# Altium project DigiBuckBoostConverter.PrjPcb
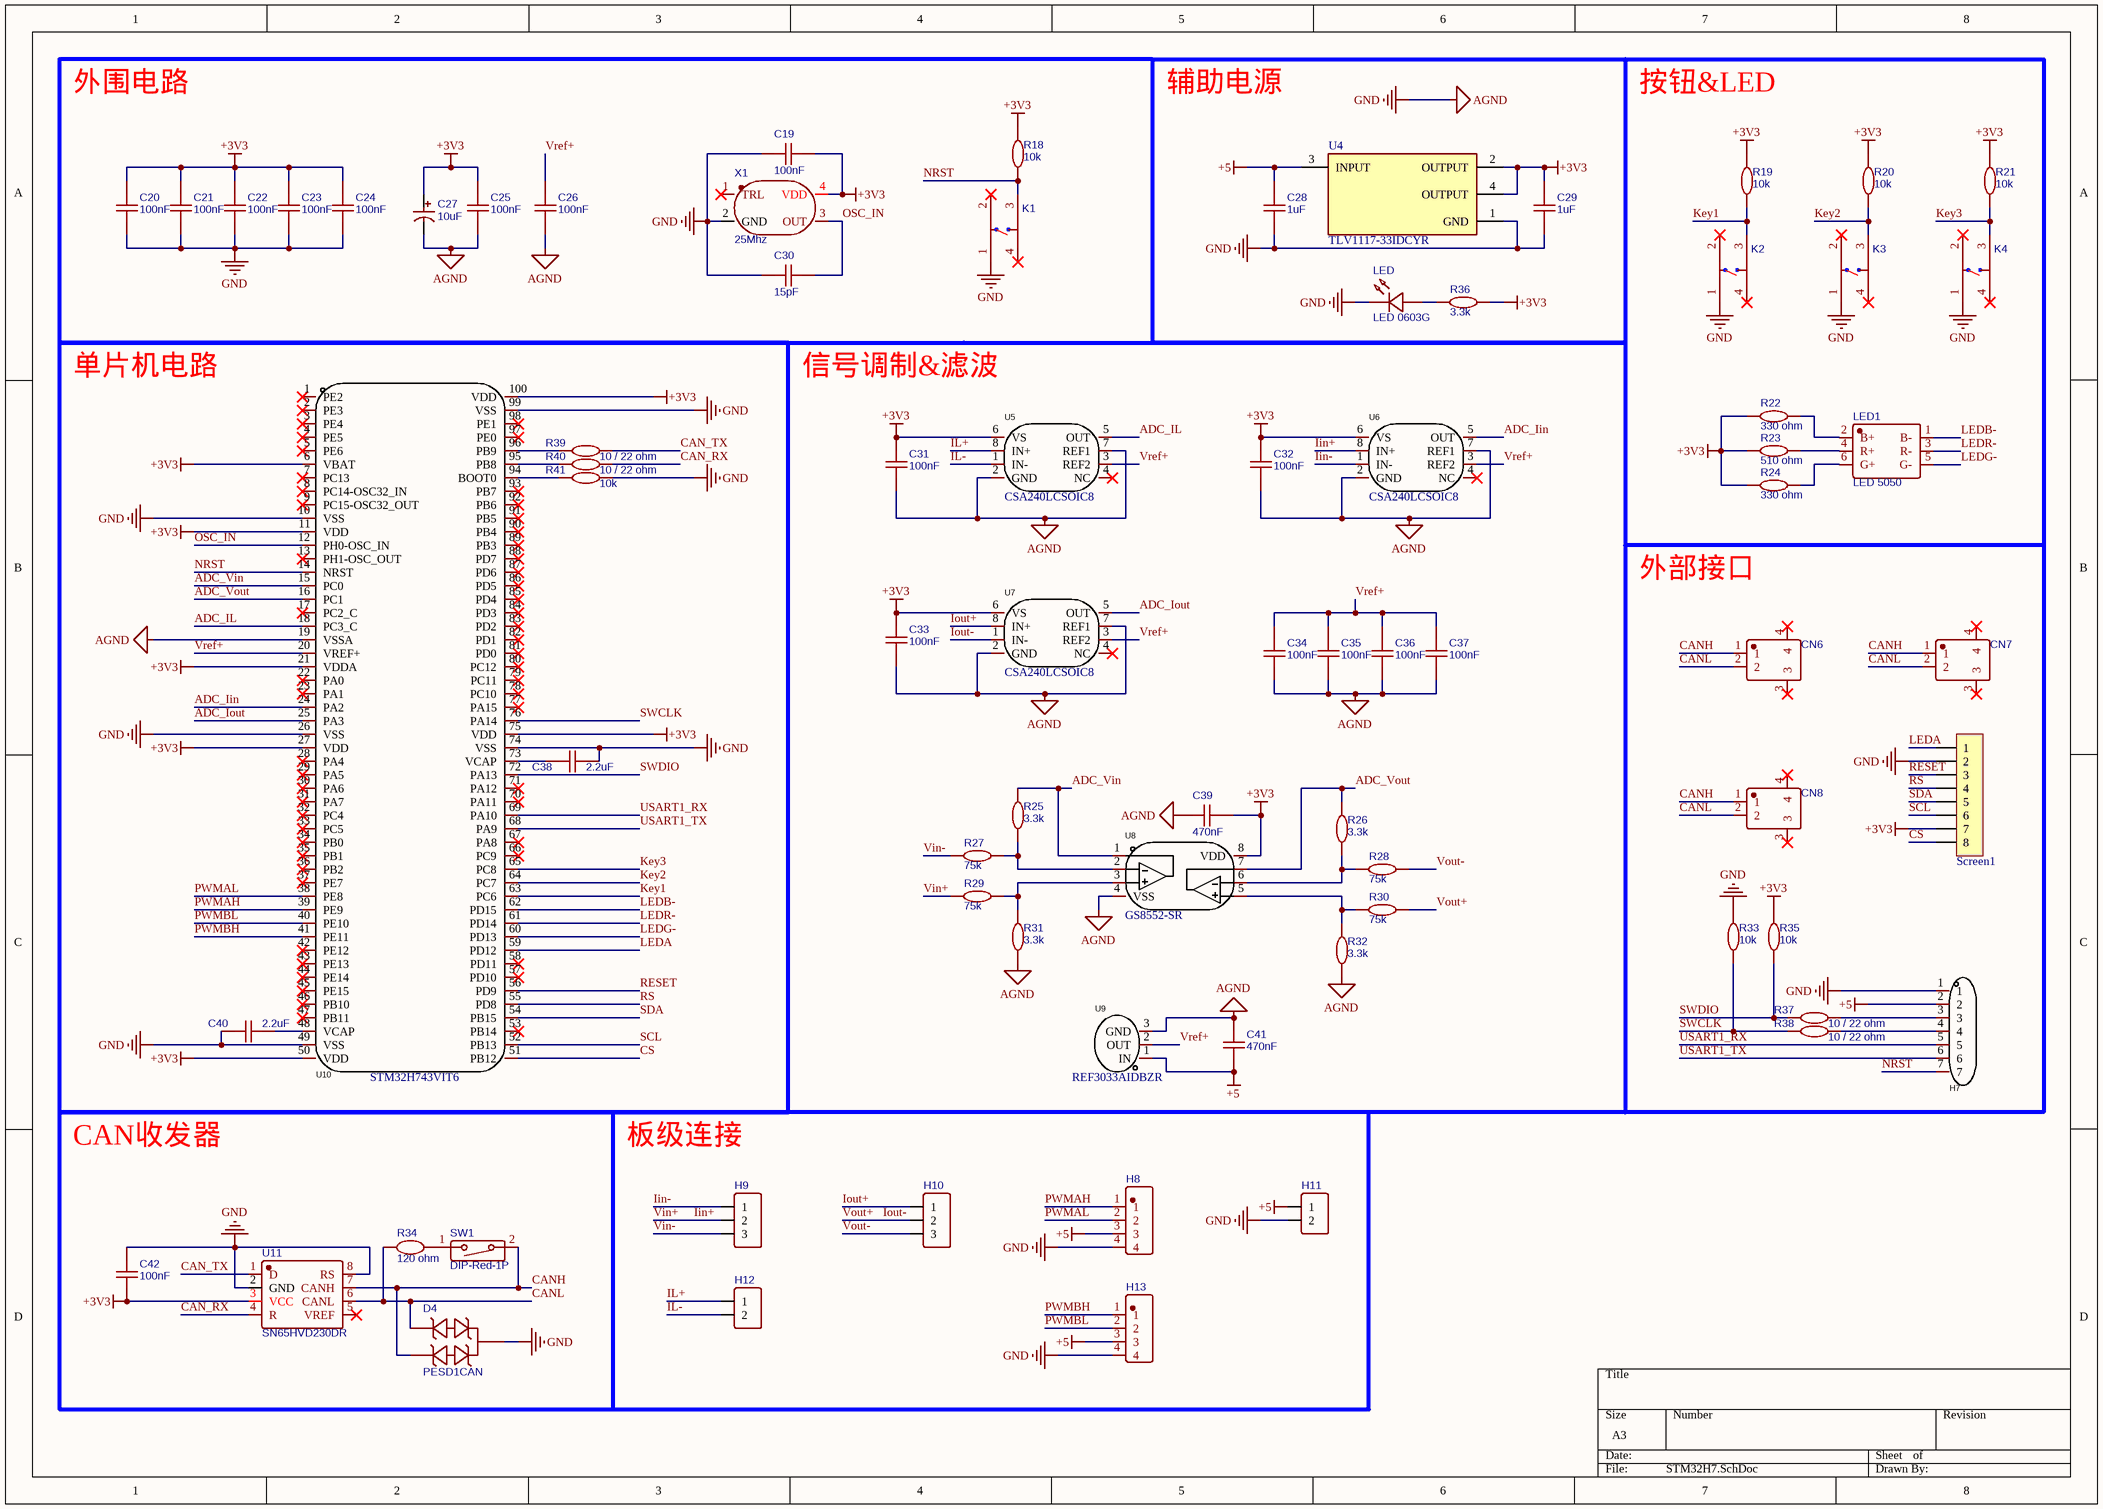
[diagram p0: STM32H7.SchDoc]
1 sheet, 76 parts. Net scope: global (net labels, ports and power ports of the same name join across sheets).
Board files: STM32H7.PcbDoc, mainPower_V2.PcbDoc

## Sheet STM32H7.SchDoc
size A3; SheetNumber: 2; SheetTotal: 2

### Parts
C19  100nF  [C0603]
C20  100nF  [C0603]
C21  100nF  [C0603]
C22  100nF  [C0603]
C23  100nF  [C0603]
C24  100nF  [C0603]
C25  100nF  [C0603]
C26  100nF  [C0603]
C27  10uF  [CD A(3216)]
C28  1uF  [C0603]
C29  1uF  [C0603]
C30  15pF  [C0603]
C31  100nF  [C0603]
C32  100nF  [C0603]
C33  100nF  [C0603]
C34  100nF  [C0603]
C35  100nF  [C0603]
C36  100nF  [C0603]
C37  100nF  [C0603]
C38  2.2uF  [C0603]
C39  470nF  [C0603]
C40  2.2uF  [C0603]
C41  470nF  [C0603]
C42  100nF  [C0603]
CN6  A1257WR-S-2P  [CONN-SMD_A1257WR-S-2P]  (value not drawn)
CN7  A1257WR-S-2P  [CONN-SMD_A1257WR-S-2P]  (value not drawn)
CN8  A1257WR-S-2P  [CONN-SMD_A1257WR-S-2P]  (value not drawn)
D4  PESD1CAN  [SOT-23-3_L2.9-W1.6-P1.90-LS2.8-BR]
H7  7P卧贴排母  [HDR-SMD_7P-P2.54-H-F-L11.5]  (value not drawn)
H8  Header-Female-2.54_1x4  [HDR2.54-M-LI-4P]  (value not drawn)
H9  Header-Female-2.54_1x3  [HDR2.54-M-LI-3P]  (value not drawn)
H10  Header-Female-2.54_1x3  [HDR2.54-M-LI-3P]  (value not drawn)
H11  Header-Female-2.54_1x2  [HDR2.54-M-LI-2P]  (value not drawn)
H12  Header-Female-2.54_1x2  [HDR2.54-M-LI-2P]  (value not drawn)
H13  Header-Female-2.54_1x4  [HDR2.54-M-LI-4P]  (value not drawn)
K1  TSW SMD-6*6*5  [TSW SMD-6*6*5]  (value not drawn)
K2  TSW SMD-6*6*5  [TSW SMD-6*6*5]  (value not drawn)
K3  TSW SMD-6*6*5  [TSW SMD-6*6*5]  (value not drawn)
K4  TSW SMD-6*6*5  [TSW SMD-6*6*5]  (value not drawn)
LED  LED 0603G  [LED 0603G]
LED1  LED 5050  [LED 5050]
R18  10k  [R0603]
R19  10k  [R0603]
R20  10k  [R0603]
R21  10k  [R0603]
R22  330 ohm  [R0603]
R23  510 ohm  [R0603]
R24  330 ohm  [R0603]
R25  3.3k  [R0603]
R26  3.3k  [R0603]
R27  75k  [R0603]
R28  75k  [R0603]
R29  75k  [R0603]
R30  75k  [R0603]
R31  3.3k  [R0603]
R32  3.3k  [R0603]
R33  10k  [R0603]
R34  120 ohm  [R0805]
R35  10k  [R0603]
R36  3.3k  [R0603]
R37  10 / 22 ohm  [R0603]
R38  10 / 22 ohm  [R0603]
R39  10 / 22 ohm  [R0603]
R40  10 / 22 ohm  [R0603]
R41  10k  [R0603]
Screen1  FPC1.0-8P  [FPC0.5 2H-S-W-8P]  (value not drawn)
SW1  DIP-Red-1P  [CSW DIP-1P_G]
U4  TLV1117-33IDCYR  [FP-DCY0004A-MFG]
U5  CSA240LCSOIC8  [SOIC-8_L4.9-W3.9-P1.27-LS6.0-BL]
U6  CSA240LCSOIC8  [SOIC-8_L4.9-W3.9-P1.27-LS6.0-BL]
U7  CSA240LCSOIC8  [SOIC-8_L4.9-W3.9-P1.27-LS6.0-BL]
U8  GS8552-SR  [SOIC-8_L4.9-W3.9-P1.27-LS6.0-BL]
U9  REF3033AIDBZR  [SOT-23-3_L3.0-W1.7-P0.95-LS2.9-BR]
U10  STM32H743VIT6  [LQFP-100_L14.0-W14.0-P0.50-LS16.0-BL]
U11  SN65HVD230DR  [SOP-8]
X1  25Mhz  [OSC 3225-4P]

### Blocks framed on the sheet
外围电路: C19-C27 C30 K1 R18 X1
辅助电源: C28 C29 LED R36 U4
单片机电路: C38 C40 R39-R41 U10
信号调制&滤波: C31-C37 C39 C41 R25-R32 U5-U9

### Nets
+3V3: C19.2 C20.2 C21.2 C22.2 C23.2 C24.2 C25.1 C27.1 C29.2 C31.2 C32.2 C33.2 C39.2 C42.1 R18.2 R19.2 R20.2 R21.2 R22.2 R23.2 R24.2 R35.2 R36.1 Screen1.7 U4.2(OUTPUT) U4.4(OUTPUT) U5.6(VS) U6.6(VS) U7.6(VS) U8.8(VDD) U10.6(VBAT) U10.11(VDD) U10.21(VDDA) U10.27(VDD) U10.50(VDD) U10.75(VDD) U10.100(VDD) U11.3(VCC) X1.4(VDD)
+5: C28.2 C41.1 H7.2 H8.3 H11.1 H13.3 U4.3(INPUT) U9.1(IN)
AGND: C19.1 C20.1 C21.1 C22.1 C23.1 C24.1 C25.2 C26.1 C27.2 C28.1 C29.1 C30.2 C31.1 C32.1 C33.1 C34.2 C35.1 C36.1 C37.2 C38.1 C39.1 C40.2 C41.2 C42.2 D4.3 H7.1 H8.4 H11.2 H13.4 K1.1 K2.1 K3.1 K4.1 LED.2(K) R31.1 R32.1 R33.2 R41.1 Screen1.2 U4.1(GND) U5.2(GND) U5.7(REF1) U6.2(GND) U6.7(REF1) U7.2(GND) U7.7(REF1) U8.4(VSS) U9.3(GND) U10.10(VSS) U10.19(VSSA) U10.26(VSS) U10.49(VSS) U10.74(VSS) U10.99(VSS) U11.2(GND) U11.8(RS) X1.2(GND)  [also labelled GND]
ADC_Iin: U6.5(OUT) U10.24(PA2)
ADC_IL: U5.5(OUT) U10.18(PC3_C)
ADC_Iout: U7.5(OUT) U10.25(PA3)
ADC_Vin: R25.2 U8.1(OUTA) U10.15(PC0)
ADC_Vout: R26.2 U8.7(OUTB) U10.16(PC1)
CAN_RX: R40.1 U11.4(R)
CAN_TX: R39.1 U11.1(D)
CANH: CN6.1 CN7.1 CN8.1 D4.2 SW1.2 U11.7(CANH)
CANL: CN6.2 CN7.2 CN8.2 D4.1 R34.1 U11.6(CANL)
CS: Screen1.8 U10.51(PB12)
Iin+: H9.2 R29.1 U6.8(IN+)  [also labelled Vin+]
Iin-: H9.1 U6.1(IN-)
IL+: H12.1 U5.8(IN+)
IL-: H12.2 U5.1(IN-)
Iout+: H10.1 U7.8(IN+)
Iout-: H10.2 R30.2 U7.1(IN-)  [also labelled Vout+]
Key1: K2.3 R19.1 U10.63(PC6)
Key2: K3.3 R20.1 U10.64(PC7)
Key3: K4.3 R21.1 U10.65(PC8)
LEDA: Screen1.1 U10.59(PD12)
LEDB-: LED1.1(B-) U10.62(PD15)
LEDG-: LED1.5(G-) U10.60(PD13)
LEDR-: LED1.3(R-) U10.61(PD14)
NRST: H7.7 K1.3 R18.1 U10.14(NRST)
OSC_IN: C30.1 U10.12(PH0-OSC_IN) X1.3(OUT)
PWMAH: H8.1 U10.39(PE9)
PWMAL: H8.2 U10.38(PE8)
PWMBH: H13.1 U10.41(PE11)
PWMBL: H13.2 U10.40(PE10)
RESET: Screen1.3 U10.56(PD9)
RS: Screen1.4 U10.55(PD8)
SCL: Screen1.6 U10.52(PB13)
SDA: Screen1.5 U10.54(PB15)
SWCLK: R33.1 R38.2 U10.76(PA14)
SWDIO: R35.1 R37.2 U10.72(PA13)
USART1_RX: H7.5 U10.69(PA10)
USART1_TX: H7.6 U10.68(PA9)
Vin-: H9.3 R27.1
Vout-: H10.3 R28.2
Vref+: C26.2 C34.1 C35.2 C36.2 C37.1 U5.3(REF2) U6.3(REF2) U7.3(REF2) U9.2(OUT) U10.20(VREF+)
NetC38_2: C38.2 U10.73(VCAP)
NetC40_1: C40.1 U10.48(VCAP)
NetH7_3: H7.3 R37.1
NetH7_4: H7.4 R38.1
NetLED1_2: LED1.2(B+) R22.1
NetLED1_4: LED1.4(R+) R23.1
NetLED1_6: LED1.6(G+) R24.1
NetLED_1: LED.1(A) R36.2
NetR25_1: R25.1 R27.2 U8.2(INA-)
NetR26_1: R26.1 R28.1 U8.6(INB-)
NetR29_2: R29.2 R31.2 U8.3(INA+)
NetR30_1: R30.1 R32.2 U8.5(INB+)
NetR34_2: R34.2 SW1.1
NetR39_2: R39.2 U10.96(PB9)
NetR40_2: R40.2 U10.95(PB8)
NetR41_2: R41.2 U10.94(BOOT0)

Not connected (* = marked no-connect by the designer): CN6 3* 4*; CN7 3* 4*; CN8 3* 4*; K1 2* 4*; K2 2* 4*; K3 2* 4*; K4 2* 4*; U5 4(NC)*; U6 4(NC)*; U7 4(NC)*; U10 1(PE2)* 2(PE3)* 3(PE4)* 4(PE5)* 5(PE6)* 7(PC13)* 8(PC14-OSC32_IN)* 9(PC15-OSC32_OUT)* 13(PH1-OSC_OUT)* 17(PC2_C)* 22(PA0)* 23(PA1)* 28(PA4)* 29(PA5)* 30(PA6)* 31(PA7)* 32(PC4)* 33(PC5)* 34(PB0)* 35(PB1)* 36(PB2)* 37(PE7)* 42(PE12)* 43(PE13)* 44(PE14)* 45(PE15)* 46(PB10)* 47(PB11)* 53(PB14)* 57(PD10)* 58(PD11)* 66(PC9)* 67(PA8)* 70(PA11)* 71(PA12)* 77(PA15)* 78(PC10)* 79(PC11)* 80(PC12)* 81(PD0)* 82(PD1)* 83(PD2)* 84(PD3)* 85(PD4)* 86(PD5)* 87(PD6)* 88(PD7)* 89(PB3)* 90(PB4)* 91(PB5)* 92(PB6)* 93(PB7)* 97(PE0)* 98(PE1)*; U11 5(VREF)*; X1 1(TRL)*

### Notes on the sheet
- 按钮&LED
- 外部接口
- CAN收发器
- 板级连接

### Library data of the parts
C19-C26 C28-C42 = C0603: BOM_Manufacturer: YAGEO; BOM_Manufacturer Part: CC0603KRX7R9BB104; nameAlias: Capacitance; BOM_Supplier: LCSC; BOM_Supplier Part: C14663; BOM_JLCPCB Part Class: Basic Part; spicePre: C; spiceSymbolName: CC0603KRX7R9BB104
C27 = A型钽电容: 长3.2mm，宽1.6mm，厚1.6mm; BOM_Manufacturer: ValuePro; BOM_Manufacturer Part: 50V 100uF 8X12; nameAlias: Capacitance; BOM_Supplier: LCSC; BOM_Supplier Part: C2749; BOM_JLCPCB Part Class: Extended Part; spicePre: C; spiceSymbolName: 50V 100uF 8X12
CN6-CN8 = A1257WR-S-2P: BOM_Manufacturer: Changjiang Connectors; BOM_Manufacturer Part: A1257WV-S-2P; Contributor: LCSC; BOM_Supplier: LCSC; BOM_Supplier Part: C225118; BOM_JLCPCB Part Class: Extended Part; spicePre: C; spiceSymbolName: A1257WV-S-2P
D4 = PESD1CAN: BOM_Manufacturer: TECH PUBLIC; Contributor: LCSC; BOM_Supplier: LCSC; BOM_Supplier Part: C907838; BOM_Manufacturer Part: PESD1CAN; spicePre: D; spiceSymbolName: PESD1CAN_C907838
H7 = 7P卧贴排母: Manufacturer: XKB Connectivity(中国星坤); Name: X6511FRS-07-C85D30; Add into BOM: yes; Holes Structure: 1x7P; Pitch: 2.54mm; Number of Holes: 7P; Symbol: X6511FRS-07-C85D30; Device: X6511FRS-07-C85D30; LCSC Part Name: 间距:2.54mm 1x7P 卧贴; Supplier Part: C5142240; Manufacturer Part: X6511FRS-07-C85D30; Supplier Footprint: SMD,P=2.54mm; JLCPCB Part Class: Extended Part; Datasheet: https://atta.szlcsc.com/upload/public/pdf/source/20220822/AB9A82E80C220285963E5EFA3BFD32FF.pdf; Supplier: LCSC; Convert to PCB: yes; Mounting Type: 卧贴; Number of Rows: 单排; Insulation Height: 8.5mm
H8 H13 = Header-Female-2.54_1x4: BOM_Manufacturer: Boom Precision Elec; BOM_Manufacturer Part: C247921; Contributor: LCSC; BOM_Supplier: LCSC; BOM_Supplier Part: C247921; BOM_JLCPCB Part Class: Extended Part; spicePre: H; spiceSymbolName: C247921
H9 H10 = Header-Female-2.54_1x3: BOM_Manufacturer: BOOMELE; BOM_Manufacturer Part: Header2.54mm 1*3P; BOM_Supplier: LCSC; BOM_Supplier Part: C49257; BOM_JLCPCB Part Class: Extended Part; spicePre: H; spiceSymbolName: Header-Male-2.54_1x3
H11 H12 = Header-Female-2.54_1x2: BOM_Manufacturer: BOOMELE; BOM_Manufacturer Part: Header2.54mm 1*3P; BOM_Supplier: LCSC; BOM_Supplier Part: C49257; BOM_JLCPCB Part Class: Extended Part; spicePre: H; spiceSymbolName: Header-Male-2.54_1x3
K1-K4 = TSW SMD-6*6*5: BOM_Manufacturer: GANGYUAN(港源); BOM_Manufacturer Part: KAN0661-1001B; Contributor: LCSC; BOM_Supplier: LCSC; BOM_Supplier Part: C231715; BOM_JLCPCB Part Class: Extended Part; spicePre: S; spiceSymbolName: KAN0661-1001B
LED = LED 0603G: 绿色0603LED; BOM_Manufacturer: EVERLIGHT(台湾亿光); BOM_Manufacturer Part: 11-21/BHC-AQ2S2/2T; Contributor: lcsc; BOM_Supplier: LCSC; BOM_Supplier Part: C3014404; spicePre: L; spiceSymbolName: 11-21/BHC-AQ2S2/2T
LED1 = LED 5050: 5050RGB-LED; BOM_Manufacturer: EVERLIGHT(台湾亿光); BOM_Manufacturer Part: 11-21/BHC-AQ2S2/2T; Contributor: lcsc; BOM_Supplier: LCSC; BOM_Supplier Part: C3014404; spicePre: L; spiceSymbolName: 11-21/BHC-AQ2S2/2T
R18-R33 R35-R41 = R0603: BOM_Manufacturer: YAGEO; BOM_Manufacturer Part: SR0603JR-071RL; nameAlias: Resistance (Ohms); Contributor: LCSC; Resistance: 1Ω; BOM_Supplier: LCSC; BOM_Supplier Part: C326890; BOM_JLCPCB Part Class: Extended Part; spicePre: R; spiceSymbolName: SR0603JR-071RL
R34 = R0805: BOM_Manufacturer: YAGEO; BOM_Manufacturer Part: SR0805FR-0710RL; Contributor: LCSC; Resistance: 10Ω; BOM_Supplier: LCSC; BOM_Supplier Part: C723409; BOM_JLCPCB Part Class: Extended Part; spicePre: R; spiceSymbolName: SR0805FR-0710RL
Screen1 = FPC-8P-0.5: FPC连接器; 版权归属: 黎明电子style; BOM名称: FPC连接器; 学习资源: https://lmdzstyle.taobao.com/
SW1 = DIP-Red-1P: BOM_Manufacturer: East Wei Elec; BOM_Manufacturer Part: VDG-10HG-R; Contributor: LCSC; BOM_Supplier: LCSC; BOM_Supplier Part: C45226; BOM_JLCPCB Part Class: Extended Part; spicePre: S; spiceSymbolName: VDG-10HG-R
U4 = CMP-04917-000056-1: IC REG LIN 3.3V 800MA SOT223-4; Manufacturer: Texas Instruments; Nominal Supply Current: 5mA; Dropout Voltage: 1.2V; Max Supply Voltage: 15V; Min Supply Voltage: 4.7V; Output Type: Fixed; Number Of Outputs: 1; Output Current: 0.8A; Standoff Height: 0.02mm; Max Junction Temp: +125°C; Lead Free: Yes; RoHS: TRUE; Temperature: -40°C to +125°C; Device Class L1: Integrated Circuits (ICs); Output Voltage: 3.3V; Device Class L3: Voltage Regulators - Linear; Octopart: https://octopart.com/tlv1117-33idcyr-texas+instruments-669250; Device Class L2: Power Management ICs; Package: DCY0004A; Temperature Range High: +125°C; Category: IC; Height: 1.8mm; Automotive: No; Digikey Description: IC REG LIN 3.3V 800MA SOT223-4; Temperature Range Low: -40°C; ComponentLink2URL: http://www.ti.com/lit/ds/symlink/tlv1117.pdf; ComponentLink2Description: Datasheet; Manufacturer Part Number: TLV1117-33IDCYR; Mouser Description: LDO Voltage Regulators Fixed LDO Volt Reg
U5-U7 = CSA240LCSOIC8: 低噪声低温漂双向电流高端检测芯片; Manufacturer: analogysemi(类比半导体); Add into BOM: yes; Number of Channels: 1; Common Mode Voltage: 6V~80V; Gain: 20V/V; Supply Voltage: 2.7V~5.5V; Name: CSA240LCSOIC8; Symbol: CSA240LCSOIC8; Device: CSA240LCSOIC8; LCSC Part Name: 线性产品; Supplier Part: C5359411; Manufacturer Part: CSA240LCSOIC8; Supplier Footprint: SOIC-8; JLCPCB Part Class: Extended Part; Datasheet: https://atta.szlcsc.com/upload/public/pdf/source/20230221/4ACBE0500A397B3D4468D76F97F173B7.pdf; Supplier: LCSC; Convert to PCB: yes; Operating Temperature: -40℃~125℃
U8 = GS8552-SR: 1.5MHZ, 轨到轨高精双通道运放; Manufacturer: Gainsil(聚洵); Add into BOM: yes; Number of Circuits: 双路; Supply Voltage: 1.8V~5.5V; Gain Bandwidth Product(GBP): 1.8MHz; Slew Rate(SR): 0.95V/us; Supply Current: 180uA; Name: GS8552-SR; Symbol: GS8552-SR; Device: GS8552-SR; LCSC Part Name: GS8552-SR; Supplier Part: C157716; Manufacturer Part: GS8552-SR; Supplier Footprint: SOIC-8; JLCPCB Part Class: Extended Part; Datasheet: https://atta.szlcsc.com/upload/public/pdf/source/20200615/C605420_EE0E567F8FF01D919583B114644E1CC3.pdf; Supplier: LCSC; Convert to PCB: yes; Operating Temperature: -40℃~+125℃
U9 = REF3033AIDBZR: 3.3V基准电压源; Manufacturer: TI(德州仪器); Add into BOM: yes; Reference Type: 串联; Output Type: 固定; Input Voltage: 3.35V~5.5V; Output Voltage: 3.3V; Output Current: 25mA; Tolerance: ±0.2%; Temperature Coefficient: 75ppm/℃; Supply Current: 50uA; Noise - 10Hz to 10kHz: 105uVrms; Name: REF3033AIDBZR; Symbol: REF3033AIDBZR; Device: REF3033AIDBZR; LCSC Part Name: REF3033AIDBZR; Supplier Part: C36658; Manufacturer Part: REF3033AIDBZR; Supplier Footprint: SOT-23; JLCPCB Part Class: Extended Part; Datasheet: https://www.ti.com/cn/lit/gpn/ref3020; Supplier: LCSC; Convert to PCB: yes; Operating Temperature: -40℃~+125℃@(Ta)
U10 = STM32H743VIT6: STM32H7; Manufacturer: ST(意法半导体); Symbol: STM32H743VIT6_C114409; Add into BOM: yes; CPU Maximum Speed: 480MHz; Operating Voltage Range: 1.71V~3.6V; Program Storage Size: 2MB; GPIO Ports Number: 82; ADC (Bit): 16bit; DAC (Bit): 12bit; Universal Serial Bus: 有; Name: STM32H743VIT6; Device: STM32H743VIT6_C114409; LCSC Part Name: 480MHz; Supplier Part: C114409; Manufacturer Part: STM32H743VIT6; Supplier Footprint: LQFP-100(14x14); JLCPCB Part Class: Extended Part; Datasheet: https://atta.szlcsc.com/upload/public/pdf/source/20200508/C529058_DA70143F266D6D825C3A912656F12A87.pdf; Supplier: LCSC; Convert to PCB: yes; Watchdog: 有; Infrared Data Association: 有; Low-Voltage Detect: 有; LCD Module: 有; Secure Digital Input and Output: 有; Direct Memory Access: 有; Internal Oscillator: 有; Operating Temperature Range: -40℃~+85℃
U11 = SN65HVD230DR: 常用CAN收发器; BOM_Manufacturer: TI; BOM_Supplier: LCSC; BOM_Manufacturer Part: SN65HVD230DR; BOM_Supplier Part: C12084; BOM_JLCPCB Part Class: Basic Part; spicePre: U; spiceSymbolName: SN65HVD230DR
X1 = OSC-3225: BOM_Manufacturer: TAE(雅晶鑫); BOM_Manufacturer Part: TFOM8M4RHKCNT2T; Contributor: LCSC; BOM_Supplier: LCSC; BOM_Supplier Part: C454610; BOM_JLCPCB Part Class: Extended Part; spicePre: X; spiceSymbolName: TFOM8M4RHKCNT2T